# Altium schematic sheet MCU.SchDoc
size A4; SheetNumber: 3; SheetTotal: 5
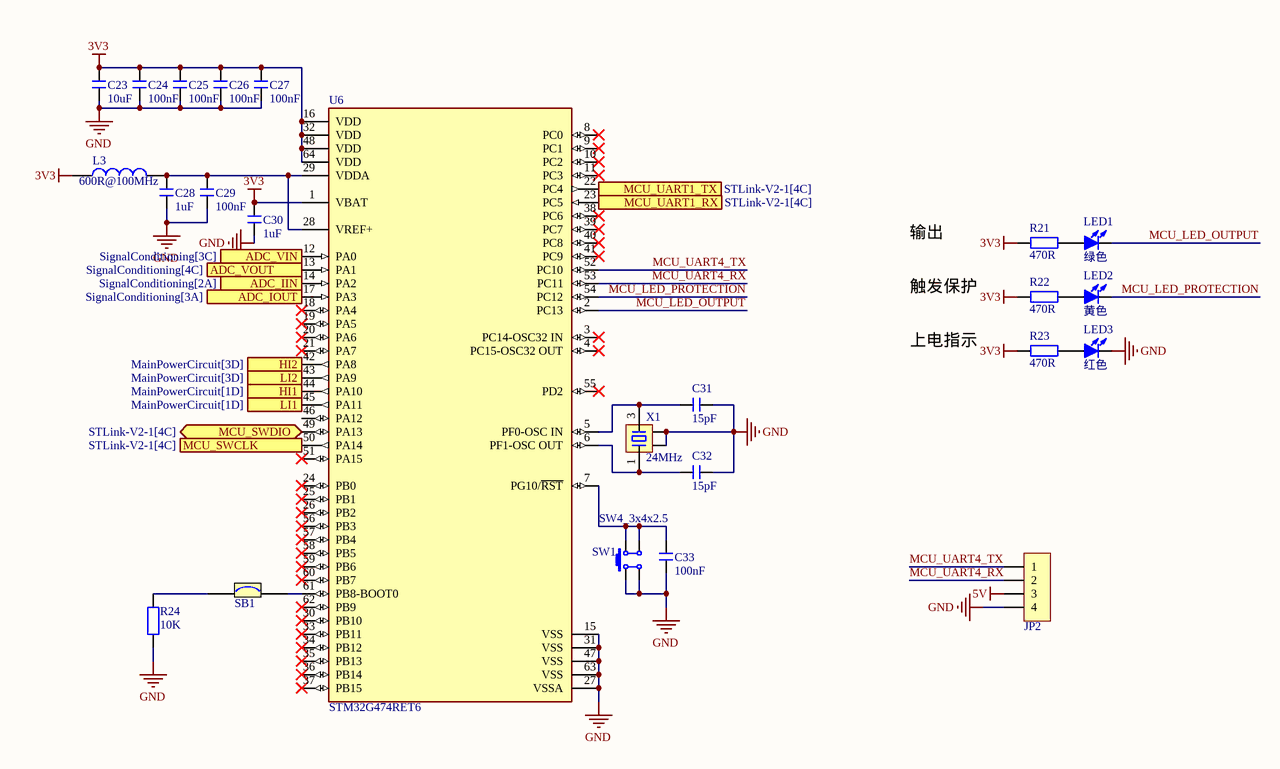
[diagram p0: MCU.SchDoc]

## Parts
C23  10uF  [C 0402_L]
C24  100nF  [C 0402_L]
C25  100nF  [C 0402_L]
C26  100nF  [C 0402_L]
C27  100nF  [C 0402_L]
C28  1uF  [C 0402_L]
C29  100nF  [C 0402_L]
C30  1uF  [C 0402_L]
C31  15pF  [C 0402_L]
C32  15pF  [C 0402_L]
C33  100nF  [C 0402_L]
JP2  HDR-1X4  [XH2.54-WI-4P]  (value not drawn)
L3  600R@100MHz  [L 0603]
LED1  绿色  [LED 0603G]
LED2  黄色  [LED 0603Y]
LED3  红色  [LED 0603R]
R21  470R  [R 0402_L]
R22  470R  [R 0402_L]
R23  470R  [R 0402_L]
R24  10K  [R 0402_L]
SB1  SelectBit  [SelectBit 0402]  (value not drawn)
SW1  SW4_3x4x2.5  [SW4_3x4x2.5]
U6  STM32G474RET6  [FP-LQFP64-5W-MFG]
X1  24MHz  [XTAL-3225-4P]

## Ports
ADC_IIN (in, see SignalConditioning[2A]), ADC_IOUT (in, see SignalConditioning[3A]), ADC_VIN (in, see SignalConditioning[3C]), ADC_VOUT (in, see SignalConditioning[4C]), HI1 (out, see MainPowerCircuit[1D]), HI2 (out, see MainPowerCircuit[3D]), LI1 (out, see MainPowerCircuit[1D]), LI2 (out, see MainPowerCircuit[3D]), MCU_SWCLK (out, see STLink-V2-1[4C]), MCU_SWDIO (bidir, see STLink-V2-1[4C]), MCU_UART1_RX (in, see STLink-V2-1[4C]), MCU_UART1_TX (out, see STLink-V2-1[4C])

## Nets
3V3: C23.2 C24.2 C25.2 C26.2 C27.2 C30.2 L3.1 R21.2 R22.2 R23.2 U6.1(VBAT) U6.16(VDD) U6.32(VDD) U6.48(VDD) U6.64(VDD)
5V: JP2.3
GND: C23.1 C24.1 C25.1 C26.1 C27.1 C28.1 C29.1 C30.1 C31.1 C32.1 C33.2 JP2.4 LED3.2(K) R24.2 SW1.1 SW1.2 U6.15(VSS) U6.27(VSSA) U6.31(VSS) U6.47(VSS) U6.63(VSS) X1.2 X1.4
ADC_IIN: U6.14(PA2) ; port ADC_IIN
ADC_IOUT: U6.17(PA3) ; port ADC_IOUT
ADC_VIN: U6.12(PA0) ; port ADC_VIN
ADC_VOUT: U6.13(PA1) ; port ADC_VOUT
HI1: U6.44(PA10) ; port HI1
HI2: U6.42(PA8) ; port HI2
LI1: U6.45(PA11) ; port LI1
LI2: U6.43(PA9) ; port LI2
MCU_LED_OUTPUT: LED1.2(K) U6.2(PC13)
MCU_LED_PROTECTION: LED2.2(K) U6.54(PC12)
MCU_SWCLK: U6.50(PA14) ; port MCU_SWCLK
MCU_SWDIO: U6.49(PA13) ; port MCU_SWDIO
MCU_UART1_RX: U6.23(PC5) ; port MCU_UART1_RX
MCU_UART1_TX: U6.22(PC4) ; port MCU_UART1_TX
MCU_UART4_RX: JP2.2 U6.53(PC11)
MCU_UART4_TX: JP2.1 U6.52(PC10)
NetC28_2: C28.2 C29.2 L3.2 U6.28(VREF+) U6.29(VDDA)
NetC31_2: C31.2 U6.5(PF0-OSC_IN) X1.3
NetC32_2: C32.2 U6.6(PF1-OSC_OUT) X1.1
NetC33_1: C33.1 SW1.3 SW1.4 U6.7(PG10/~{RST})
NetLED1_1: LED1.1(A) R21.1
NetLED2_1: LED2.1(A) R22.1
NetLED3_1: LED3.1(A) R23.1
NetR24_1: R24.1 SB1.1
NetSB1_2: SB1.2 U6.61(PB8-BOOT0)

Not connected (* = marked no-connect by the designer): U6 3(PC14-OSC32_IN)* 4(PC15-OSC32_OUT)* 8(PC0)* 9(PC1)* 10(PC2)* 11(PC3)* 18(PA4)* 19(PA5)* 20(PA6)* 21(PA7)* 24(PB0)* 25(PB1)* 26(PB2)* 30(PB10)* 33(PB11)* 34(PB12)* 35(PB13)* 36(PB14)* 37(PB15)* 38(PC6)* 39(PC7)* 40(PC8)* 41(PC9)* 46(PA12) 51(PA15)* 55(PD2)* 56(PB3)* 57(PB4)* 58(PB5)* 59(PB6)* 60(PB7)* 62(PB9)*

## Notes on the sheet
- 输出
- 触发保护
- 上电指示

## Library data of the parts
C23-C33 = C: 无极性贴片电容; 版权归属: 源创客; BOM名称: 无极性贴片电容; 学习资源: www.ooocke.com
JP2 = Header 4: 4P接插件; 封装库来自淘宝卖家 ID：黄晶宝石: 其他店铺购入均为盗版假冒封装库; 联系卖家，免费查找封装: 唯一出售店铺网址https://shop463601444.taobao.com; BOM名称: 4P接插件
L3 = L: 小功率贴片电感; 版权归属: 源创客; BOM名称: 小功率贴片电感; 学习资源: www.ooocke.com
LED1-LED3 = LED-SMD: 贴片LED; 版权归属: 源创客; BOM名称: 贴片LED; 学习资源: www.ooocke.com
R21-R24 = R: 贴片电阻; 版权归属: 源创客; BOM名称: 贴片电阻; 学习资源: www.ooocke.com
SB1 = SelectBit: 跨接桥，用于选择不同的模式，可以用锡连上，或者焊上0R电阻
U6 = CMP-12105-000051-1: MAINSTREAM ARM CORTEX-M4 CORE WI; Manufacturer: STMicroelectronics; Ram Size: 128KBytes; Interface: I2C,SPI,UART,USART,CAN,USB,LIN,IrDA,I2S,SMBus,Other; Number Of I2C Channels: 4; Number Of A/D Converters: 5; Number Of Timers/Counters: 14; Number Of I/Os: 52; Max Supply Voltage: 3.6V; Memory Size: 512KBytes; Number Of Adc Channels: 26; Number Of Cores: 1; Min Supply Voltage: 1.71V; Max Junction Temp: +105°C; Standoff Height: 0.05mm; Number Of Uart Channels: 6; Number Of Spi Channels: 3; Frequency: 170MHz; Data Bus Width: 32bits; Memory Type: FLASH; Number Of Pwm Channels: 32; Package: LQFP64-5W; Manufacturer Part Number: STM32G474RET6; Height: 1.6mm; Mouser Description: Microcontroller 32-Bit ARM Cortex-M4 RISC 512KB Flash 1.71V to 3.6V 64-Pin LQFP; Temperature Range High: +105°C; Octopart: https://octopart.com/stm32g474ret6-stmicroelectronics-102308483; Category: IC; Automotive: No; ComponentLink2URL: https://www.st.com/resource/en/datasheet/stm32g474cb.pdf; Temperature Range Low: -40°C; Device Class L1: Integrated Circuits (ICs); Device Class L2: Embedded Processors and Controllers; Core Architecture: ARM Cortex-M4; Ambient Temperature Range Low: -40°C; ComponentLink2Description: Datasheet; Temperature: -40°C to +105°C; Digikey Description: MAINSTREAM ARM CORTEX-M4 CORE WI; Lead Free: Yes; RoHS: TRUE; Ambient Temperature Range High: +85°C; Device Class L3: Microcontrollers; Number Of Usb Channels: 1
X1 = XTAL-4P: 4脚无源晶振(谐振器）; 联系卖家，免费查找封装: 唯一出售店铺网址https://shop463601444.taobao.com; BOM名称: 4脚无源晶振(谐振器）